# EAGLE design mbed_bob4 (EAGLE 6.4)
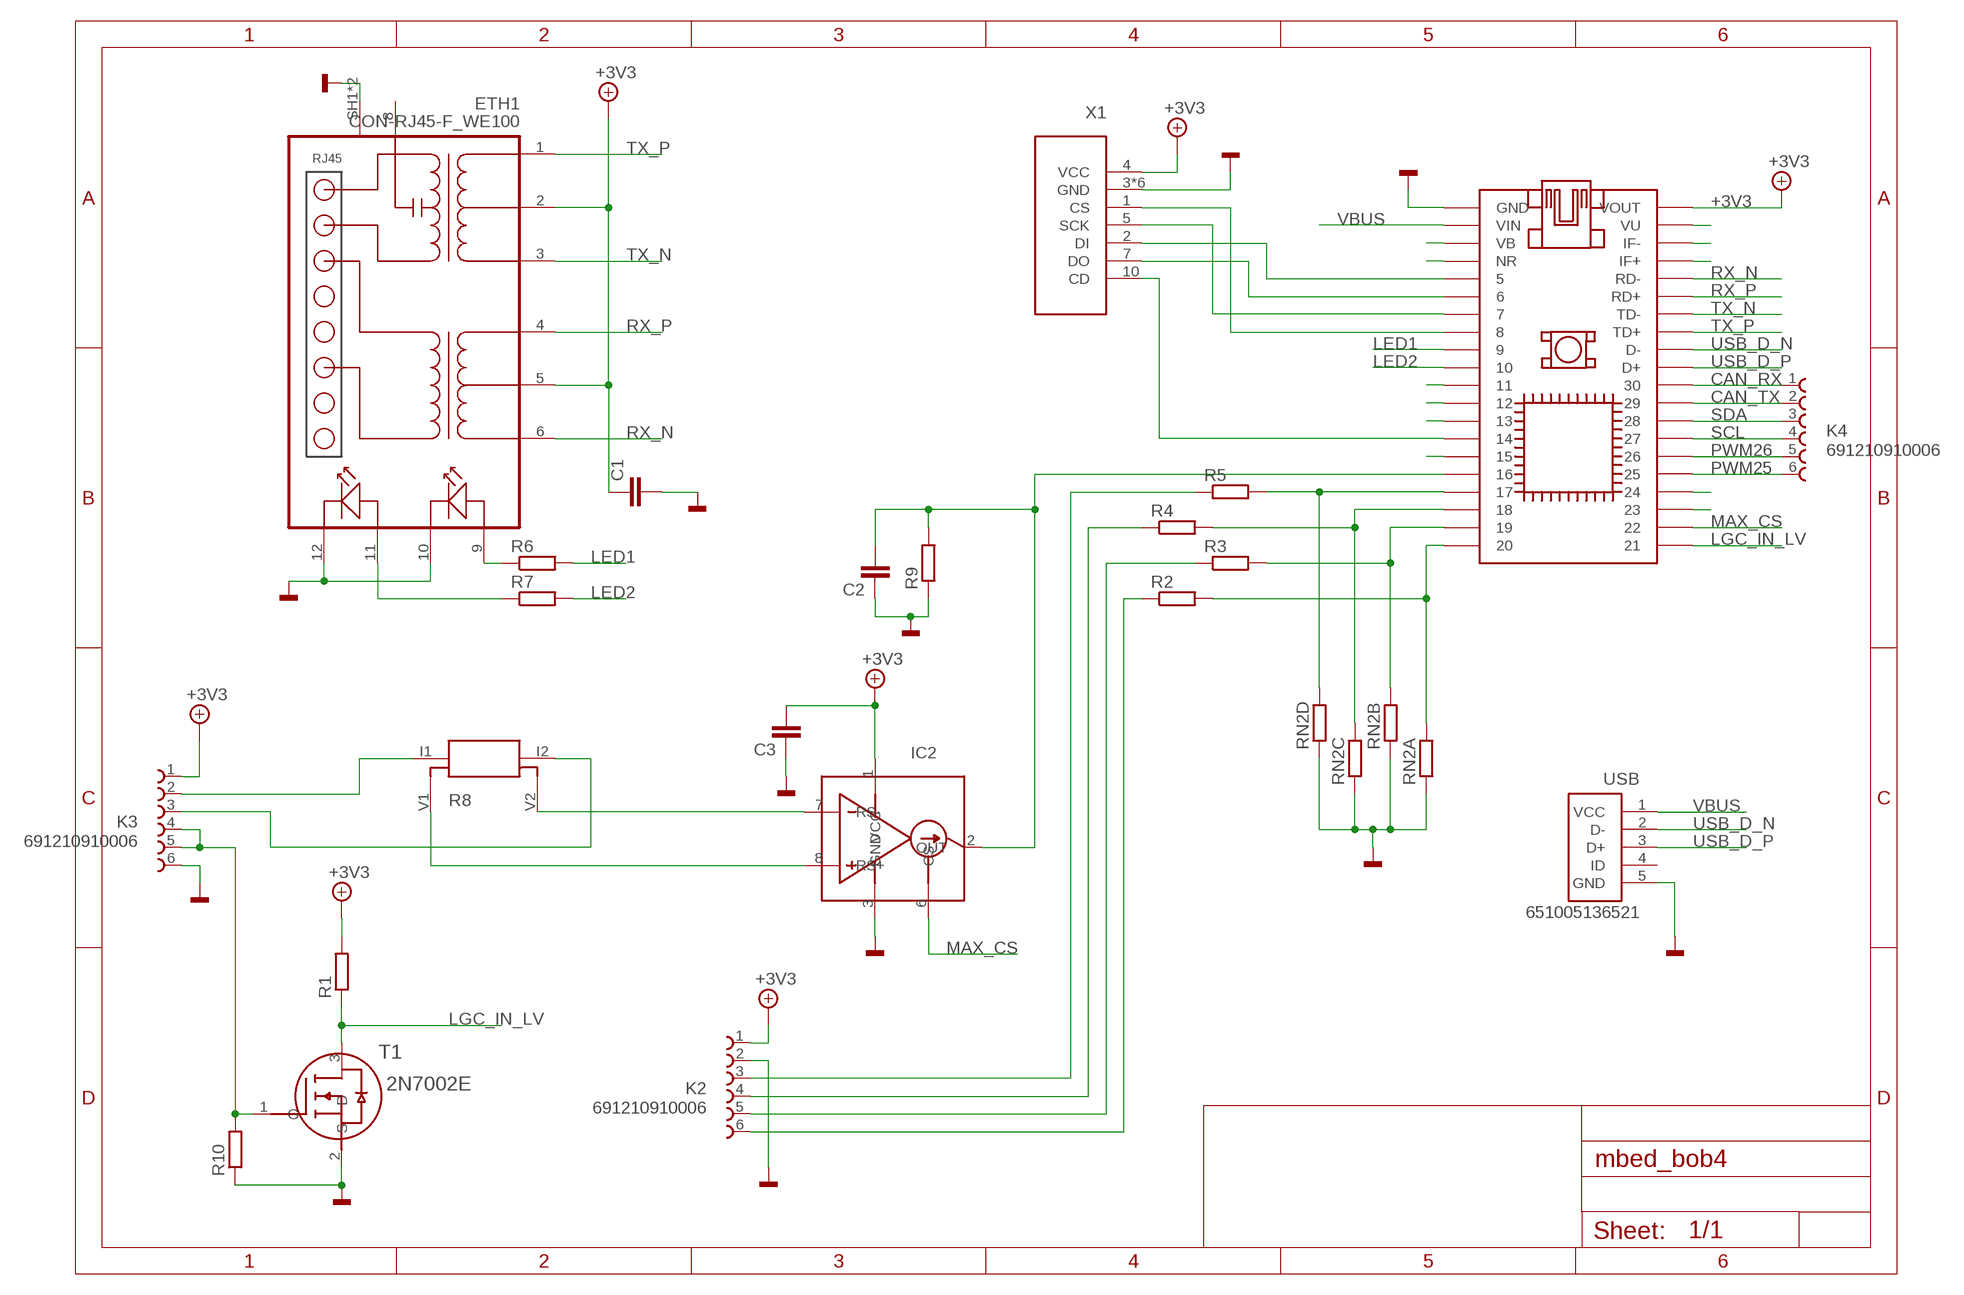
[diagram p0: schematic, sheet 1]

## Parts
C1  C0805_RFLW  [0805_RFLW]
C2  C0805_RFLW  [0805_RFLW]
C3  C0805_RFLW  [0805_RFLW]
ETH1  CON-RJ45-F_WE100  [74990111215A]
IC1  MBED-SOCKET  [MBED-SOCKET]
IC2  MAX9934  [UMAX8]
K2  691210910006  [691210910006]
K3  691210910006  [691210910006]
K4  691210910006  [691210910006]
R1  R0805_RFLW  [0805_RFLW]
R2  R0805_RFLW  [0805_RFLW]
R3  R0805_RFLW  [0805_RFLW]
R4  R0805_RFLW  [0805_RFLW]
R5  R0805_RFLW  [0805_RFLW]
R6  R0805_RFLW  [0805_RFLW]
R7  R0805_RFLW  [0805_RFLW]
R8  R_KELVIN  [R_KELVIN_1206]
R9  R0805_RFLW  [0805_RFLW]
R10  R0805_RFLW  [0805_RFLW]
RN2  RESISTOR_ARRAY_4TC164  [RN_TC164]
T1  2N7002E  [SOT23-3L]
USB  651005136521  [651005136521]
X1  SDCARDSHORT  [SD_SHORT]

## Nets
+3V3: C1.P$3 C3.P$4 ETH1.2(CTD) ETH1.5(CRD) IC1.VOUT IC1.VOUTA(VOUT) IC2.1(VCC) K2.1 K3.1 R1.P$4 X1.4(VCC)
CAN_RX: IC1.30 IC1.30A K4.1
CAN_TX: IC1.29 IC1.29A K4.2
GND: C1.P$4 C2.P$3 C3.P$3 ETH1.10(YELLOW_CATHODE) ETH1.12(GREEN_CATHODE) ETH1.SH1(SHIELD) ETH1.SH2(SHIELD) IC1.GND IC1.GNDA(GND) IC2.3(GND) K2.2 K3.6 R9.P$3 R10.P$3 RN2.1 RN2.2 RN2.3 RN2.4 T1.2(S) USB.5(GND) X1.3(GND) X1.6(GND) X1.GND@1(GND) X1.GND@2(GND) X1.GND@3(GND) X1.GND@4(GND)
LED1: IC1.9 IC1.9A R6.P$4
LED2: IC1.10 IC1.10A R7.P$4
LGC_IN_LV: IC1.21 IC1.21A R1.P$3 T1.3(D)
MAX_CS: IC1.22 IC1.22A IC2.6(CS)
N$1: IC1.17 IC1.17A R5.P$4 RN2.5
N$3: IC1.14 IC1.14A X1.10(CD)
N$4: K2.6 R2.P$3
N$5: IC1.20 IC1.20A R2.P$4 RN2.8
N$6: IC1.19 IC1.19A R3.P$4 RN2.7
N$7: IC1.18 IC1.18A R4.P$4 RN2.6
N$8: K2.5 R3.P$3
N$9: K2.4 R4.P$3
N$10: K2.3 R5.P$3
N$11: ETH1.11(GREEN_ANODE) R7.P$3
N$12: ETH1.9(YELLOW_ANODE) R6.P$3
N$13: K3.4 K3.5 R10.P$4 T1.1(G)
N$14: IC1.7 IC1.7A X1.5(SCK)
N$15: IC1.8 IC1.8A X1.1(CS)
N$16: IC1.5 IC1.5A X1.2(DI)
N$17: IC1.6 IC1.6A X1.7(DO)
N$18: IC1.VB IC1.VBA(VB)
N$19: IC1.NR IC1.NRA(NR)
N$20: IC1.11 IC1.11A
N$21: IC1.12 IC1.12A
N$22: IC1.13 IC1.13A
N$23: IC1.15 IC1.15A
N$24: C2.P$4 IC1.16 IC1.16A IC2.2(OUT) R9.P$4
N$25: K3.2 R8.I1
N$26: IC1.23 IC1.23A
N$27: IC1.24 IC1.24A
N$28: IC1.IF+ IC1.IF+A(IF+)
N$29: IC1.IF- IC1.IF-A(IF-)
N$30: IC1.VU IC1.VUA(VU)
N$31: IC2.7(RS-) R8.V2
N$32: IC2.8(RS+) R8.V1
N$33: K3.3 R8.I2
PWM25: IC1.25 IC1.25A K4.6
PWM26: IC1.26 IC1.26A K4.5
RX_N: ETH1.6(RD-) IC1.RD- IC1.RD-A(RD-)
RX_P: ETH1.4(RD+) IC1.RD+ IC1.RD+A(RD+)
SCL: IC1.27 IC1.27A K4.4
SDA: IC1.28 IC1.28A K4.3
TX_N: ETH1.3(TD-) IC1.TD- IC1.TD-A(TD-)
TX_P: ETH1.1(TD+) IC1.TD+ IC1.TD+A(TD+)
USB_D_N: IC1.D- IC1.D-A(D-) USB.2(D-)
USB_D_P: IC1.D+ IC1.D+A(D+) USB.3(D+)
VBUS: IC1.VIN IC1.VINA(VIN) USB.1(VCC)
Unconnected: ETH1.8(EXT_TAP) USB.4(ID)

## Library data of the parts
C1-C3 = passives:C: SMT capacitor
ETH1 = connectors:CON-RJ45-F: Female Ethernet RJ-45 with internal transformer and 2 LEDs; MF: Wuerth Elektronik; MPN: 74990111215A
IC1 = modules:MBED-SOCKET
IC2 = ic:MAX9934; MF: Maxim; MPN: MAX9934
K2-K4 = Wuerth_Elektronik_eiCan_14_Terminal_Blocks_WR-TBL_2_0:691210910006: WR-TBL Serie 2109 - 2.54mm Horizontal Entry Modular with Rising Cage Clamp - 0.8mm2 Wires, 6 Pins
R1-R7 R9 R10 = passives:R: SMD resistor
R8 = passives:R_KELVIN; MF: Ohmite; SERIES: LVK12
RN2 = passives:RESISTOR_ARRAY_4: 4 Resistor Array 0603; MF: Yageo
T1 = ic:2N7002E: N-channel TrenchMOS FET; MF: NXP; MPN: 2N7002E
USB = Wuerth_Elektronik_eiCan_11_Communication_Connectors_2_4:651005136521: WR-COM Horizontal 5 Contacts Mini USB Typ B
X1 = connectors:SDCARD: SD CARD holder; MF: Wuerth Elektronik; MPN: 693063020911

## Net classes
1 power: width 0.3 mm, drill 0.35 mm, clearance 0.2 mm

## Board
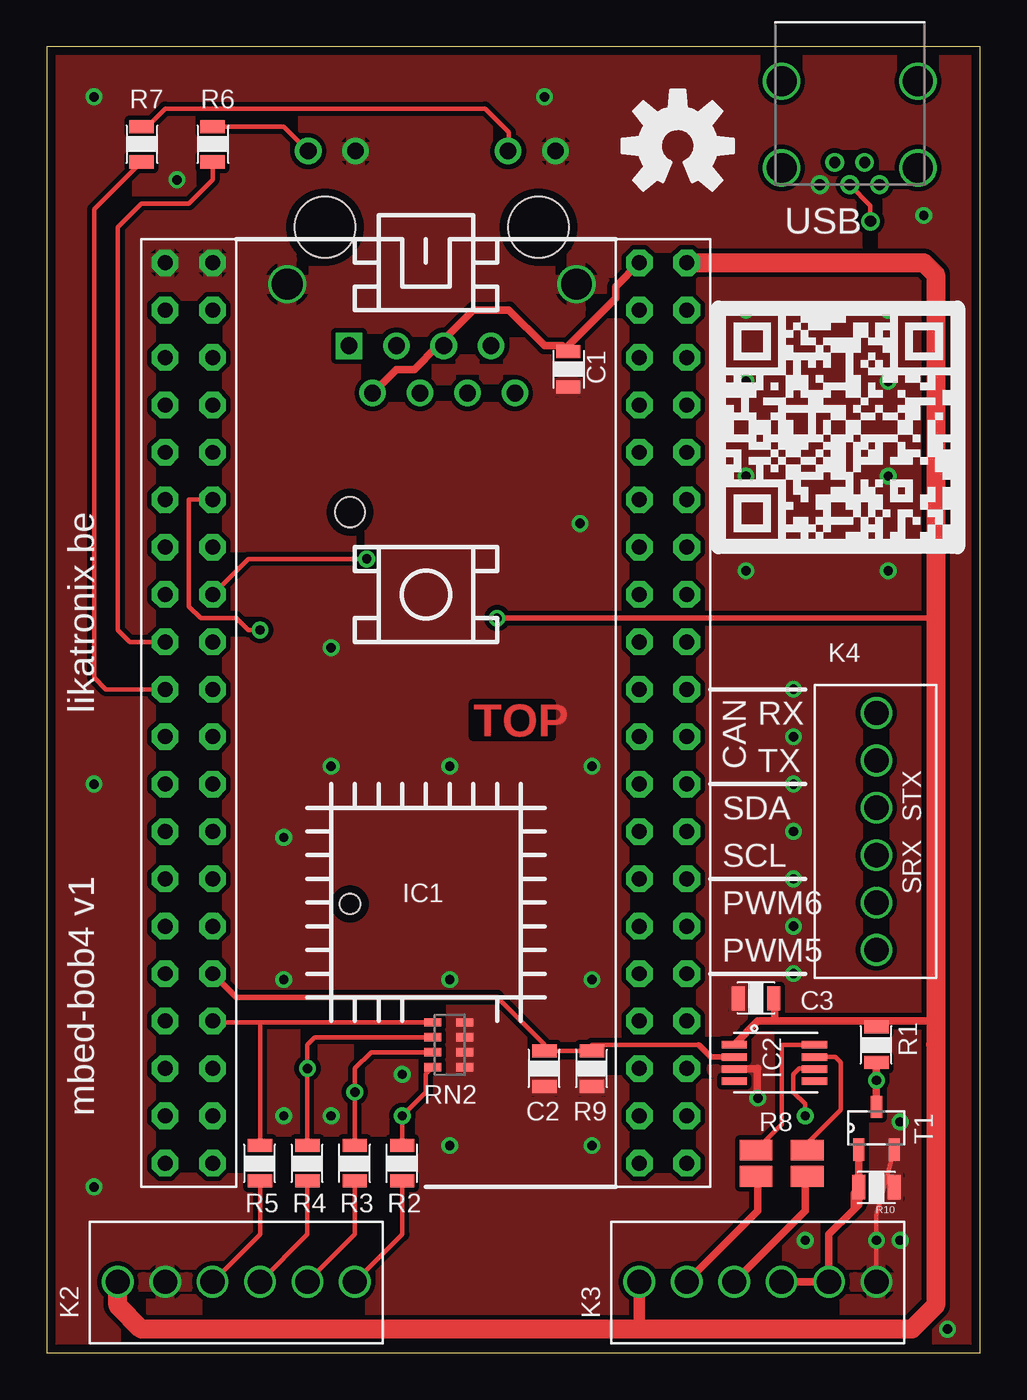
[diagram p1: board, top side]
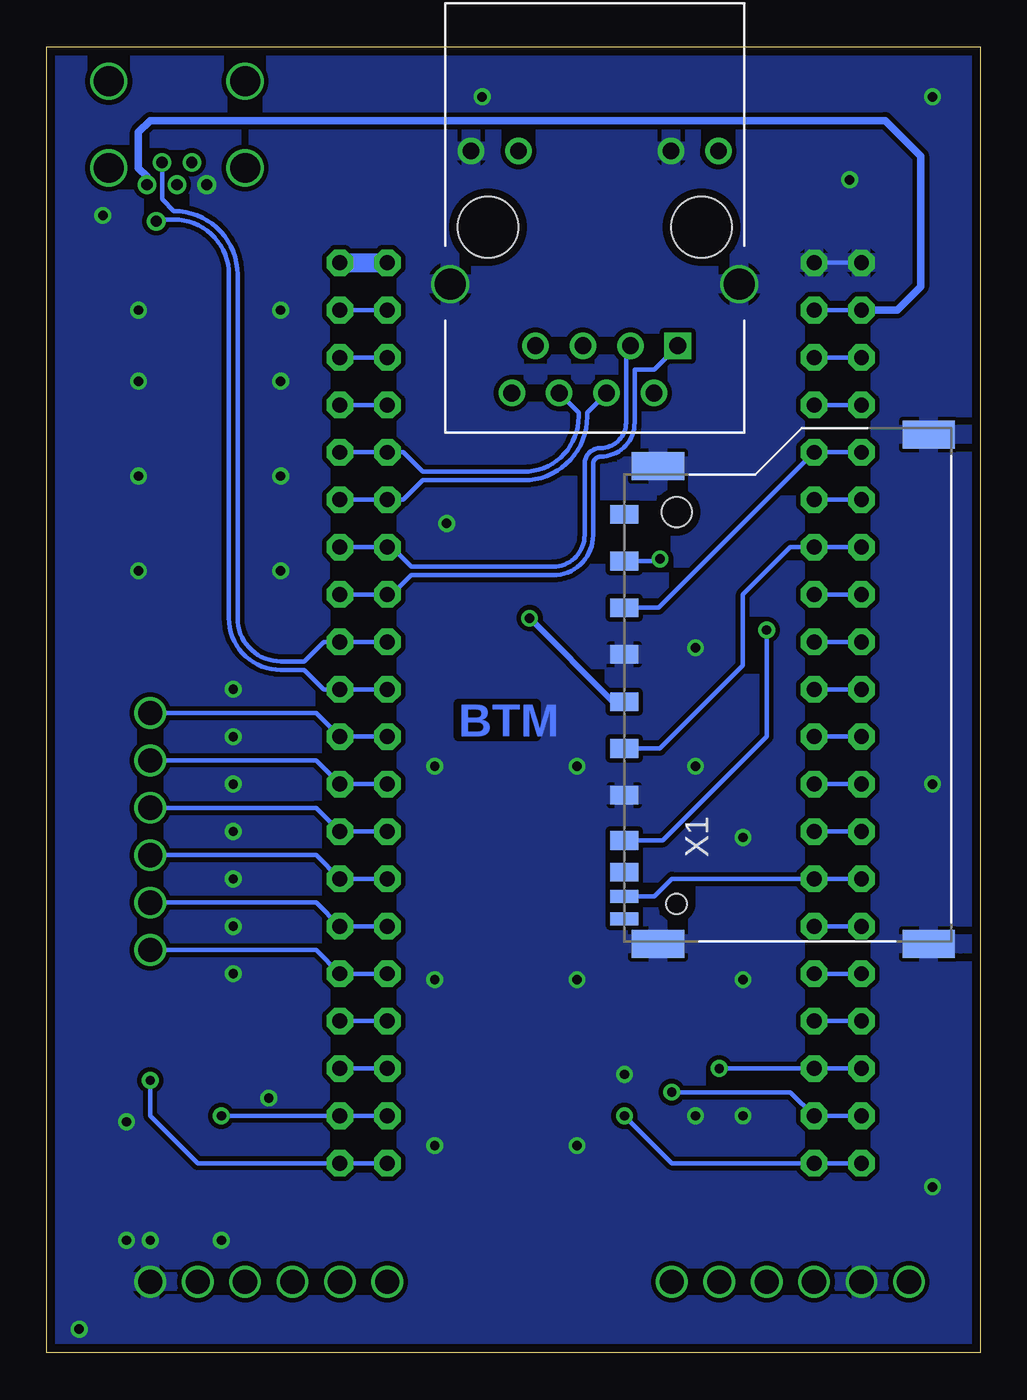
[diagram p2: board, bottom side, seen from below]

Size 50 x 70 mm. Coordinates in mm from the lower left corner, seen from the top.
Outline: 0,0 50,0 50,70 0,70 0,0
Copper layers (1*16): Top 0.018mm / dielectric 1.55mm / Bottom 0.018mm
Design rules "eC-STANDARD_pool-2-layer  *": minimum track width 0.15mm, minimum drill 0.25mm, track to track 0.15mm, track to pad 0.15mm, pad to pad 0.15mm, via to via 0.15mm, smd to smd 0.15mm, copper to edge 0.45mm, drill to drill 0.3mm, minimum pad ring 0.2mm, minimum via ring 0.2mm, stop-mask expansion 0.1mm, vias tented up to drill 0.5mm, thermal gap 0.2mm

### Footprints (pad centres in the part's own frame; a part is rotated, then mirrored left to right if it is on the bottom)
0805_RFLW = smd 0.7 x 1.3: P$3 -0.95,0; P$4 0.95,0
74990111215A = drill 0.89 pad 1.422 square: 1 4.445,-6.35 | drill 0.89 pad 1.422: 2 3.175,-8.89; 3 1.905,-6.35; 4 0.635,-8.89; 5 -0.635,-6.35; 6 -1.905,-8.89; 7 -3.175,-6.35; 8 -4.445,-8.89; 9 6.625,4.08; 10 4.085,4.08; 11 -4.085,4.08; 12 -6.625,4.08 | drill 1.65: SH1 -7.745,-3.05; SH2 7.745,-3.05 | hole 3.25: 5.715,0; -5.715,0
MBED-SOCKET = drill 0.8 pad 1.422 octagon: 5 -2.54,-10.16; 5A 0,-10.16; 6 -2.54,-12.7; 6A 0,-12.7; 7 -2.54,-15.24; 7A 0,-15.24; 8 -2.54,-17.78; 8A 0,-17.78; 9 -2.54,-20.32; 9A 0,-20.32; 10 -2.54,-22.86; 10A 0,-22.86; 11 -2.54,-25.4; 11A 0,-25.4; 12 -2.54,-27.94; 12A 0,-27.94; 13 -2.54,-30.48; 13A 0,-30.48; 14 -2.54,-33.02; 14A 0,-33.02; 15 -2.54,-35.56; 15A 0,-35.56; 16 -2.54,-38.1; 16A 0,-38.1; 17 -2.54,-40.64; 17A 0,-40.64; 18 -2.54,-43.18; 18A 0,-43.18; 19 -2.54,-45.72; 19A 0,-45.72; 20 -2.54,-48.26; 20A 0,-48.26; 21 25.4,-48.26; 21A 22.86,-48.26; 22 25.4,-45.72; 22A 22.86,-45.72; 23 25.4,-43.18; 23A 22.86,-43.18; 24 25.4,-40.64; 24A 22.86,-40.64; 25 25.4,-38.1; 25A 22.86,-38.1; 26 25.4,-35.56; 26A 22.86,-35.56; 27 25.4,-33.02; 27A 22.86,-33.02; 28 25.4,-30.48; 28A 22.86,-30.48; 29 25.4,-27.94; 29A 22.86,-27.94; 30 25.4,-25.4; 30A 22.86,-25.4; D+ 25.4,-22.86; D+A 22.86,-22.86; D- 25.4,-20.32; D-A 22.86,-20.32; GND -2.54,0; GNDA 0,0; IF+ 25.4,-7.62; IF+A 22.86,-7.62; IF- 25.4,-5.08; IF-A 22.86,-5.08; NR -2.54,-7.62; NRA 0,-7.62; RD+ 25.4,-12.7; RD+A 22.86,-12.7; RD- 25.4,-10.16; RD-A 22.86,-10.16; TD+ 25.4,-17.78; TD+A 22.86,-17.78; TD- 25.4,-15.24; TD-A 22.86,-15.24; VB -2.54,-5.08; VBA 0,-5.08; VIN -2.54,-2.54; VINA 0,-2.54; VOUT 25.4,0; VOUTA 22.86,0; VU 25.4,-2.54; VUA 22.86,-2.54
UMAX8 = smd 1.35 x 0.4: 1 0,0; 2 0,-0.65; 3 0,-1.3; 4 0,-1.95; 5 4.3,-1.95; 6 4.3,-1.3; 7 4.3,-0.65; 8 4.3,0
691210910006 = drill 1.3: 1 -2.54,0; 2 0,0; 3 2.54,0; 4 5.08,0; 5 7.62,0; 6 10.16,0
R_KELVIN_1206 = smd 1.75 x 1.1: I1 -1.375,-0.7; I2 1.375,-0.7; V1 -1.375,0.7; V2 1.375,0.7
RN_TC164 = smd 0.45 x 0.9: 1 -1.2,-0.8; 2 -0.4,-0.8; 3 0.4,-0.8; 4 1.2,-0.8; 5 1.2,0.9; 6 0.4,0.9; 7 -0.4,0.9; 8 -1.2,0.9
SOT23-3L = smd 0.6 x 1.2: 1 -0.95,-1.18; 2 0.95,-1.18; 3 0,1.12
651005136521 = drill 0.6: 1 1.6,-0.9; 2 0.8,0.3; 3 0,-0.9; 4 -0.8,0.3; 5 -1.6,-0.9 | drill 1.6: 6 -3.65,0; 7 -3.65,4.65; 8 3.65,4.65; 9 3.65,0
SD_SHORT = smd 1 x 1.5: 1 6.875,0; 2 4.375,0; 3 1.875,0; 4 -0.675,0; 5 -3.175,0; 6 -5.675,0; 7 -8.1,0; 8 -9.8,0; 9 9.375,0 | smd 0.7 x 1.5: 10 -11.1,0; 11 -12.3,0 | smd 1.5 x 2.8: GND@1 -13.65,-1.8; GND@2 -13.65,-16.3; GND@3 13.65,-16.3; GND@4 11.95,-1.8 | hole 1.1: -11.5,-2.8 | hole 1.6: 9.5,-2.8

### Placement (x,y rotation side)
C1  27.94,52.7 270 top
C2  26.67,15.24 90 top
C3  38,19 0 top
ETH1  20.64,60.33 0 bottom
IC1  8.89,58.42 0 top
IC2  36.83,16.51 0 top
K2  6.35,3.81 0 top
K3  34.29,3.81 0 top
K4  44.45,31.75 270 top
R1  44.45,16.51 90 top
R2  19.05,10.16 90 top
R3  16.51,10.16 90 top
R4  13.97,10.16 90 top
R5  11.43,10.16 90 top
R6  8.89,64.77 270 top
R7  5.08,64.77 270 top
R8  39.37,10.16 0 top
R9  29.21,15.24 90 top
R10  44.45,8.89 180 top
RN2  21.59,16.51 90 top
T1  44.45,12.06 0 top
USB  43.02,63.5 0 top
X1  19.05,35.56 90 bottom

### Tracks (layer width: path | path; a pad name or v marks a point on that pad's centre or on a via)
+3V3  (via drill 0.5)
  Top 0.254: ETH1.5 20.95,53.98 | 47.3,16.19 47.62,16.51
  Top 0.305: v24.13,39.37 47.62,39.37
  Top 0.406: 20.95,53.98 19.68,52.7 18.73,52.7 ETH1.2 | 21.27,54.29 22.86,55.88 24.77,55.88 26.67,53.98 27.62,53.98 C1.P$3 27.94,53.98 30.48,56.52 30.48,57.15 IC1.VOUTA | IC2.1 38.1,17.78 39,17.78 | 39,17.78 44.45,17.78 | 44.45,17.78 47.62,17.78 | R1.P$4 44.45,17.78 | C3.P$4 39,19 39,17.78
  Top 0.61: ETH1.5 21.27,54.29 | K3.1 31.75,1.27
  Top 1.016: IC1.VOUT 46.99,58.42 47.62,57.78 47.62,39.37 47.62,17.78 47.62,16.51 47.62,2.54 46.35,1.27 31.75,1.27 5.08,1.27 3.81,2.54 K2.1
  Bottom 0.305: X1.4 19.64,34.88 v24.13,39.37
  Bottom 1.016: IC1.VOUT IC1.VOUTA
CAN_RX
  Bottom 0.254: IC1.30A IC1.30 35.56,34.29 K4.1
CAN_TX
  Bottom 0.254: IC1.29A IC1.29 35.56,31.75 K4.2
GND  (via drill 0.5)
  Top 0.254: K3.6 44.45,7.39 T1.2
  Top 0.406: IC2.3 38.07,15.21 | 38.07,15.21 38.1,15.24 | 38.07,15.21 38.07,13.68 v38.1,13.65
  Bottom 0.254: IC1.GND IC1.GNDA
  other vias: 6.99,62.87 28.57,44.45 40.01,25.4 40.01,27.94 40.01,30.48 40.01,33.02 45.09,41.91 45.09,46.99 45.09,52.07 37.47,52.07 37.47,46.99 37.47,41.91 19.05,14.92 15.24,12.7 12.7,12.7 12.7,20 21.59,20 12.7,27.62 15.24,31.43 15.24,37.78 21.59,31.43 45.72,6.03 44.45,6.03 45.72,12.38 40.64,6.03 40.01,22.86 40.01,20.32 40.01,35.56 37.47,55.88 45.09,55.88 21.59,11.11 29.21,11.11 29.21,20 29.21,31.43 2.54,8.89 2.54,30.48 2.54,67.31 26.67,67.31 46.99,60.96 48.26,1.27
  pour Bottom (isolate 0.25): 0,0 0,69.85 49.53,69.85 49.53,0
  pour Top (isolate 0.25): 0,0 0,69.85 49.53,69.85 49.53,0
LED1
  Top 0.254: R6.P$4 8.89,62.87 7.62,61.59 5.08,61.59 3.81,60.33 3.81,38.73 4.45,38.1 IC1.9
  Bottom 0.254: IC1.9A IC1.9
LED2
  Top 0.254: IC1.10 3.17,35.56 2.54,36.2 2.54,61.28 R7.P$4
  Bottom 0.254: IC1.10A IC1.10
LGC_IN_LV  (via drill 0.5)
  Top 0.406: T1.3 v44.45,14.61 R1.P$3
  Bottom 0.254: IC1.21A IC1.21 41.91,10.16 44.45,12.7 v44.45,14.61
MAX_CS  (via drill 0.5)
  Top 0.254: v40.64,12.7 40.64,13.34 40.01,13.97 40.01,14.92 40.32,15.24 41.1,15.24 IC2.6
  Bottom 0.254: IC1.22A IC1.22 v40.64,12.7
N$1
  Top 0.254: RN2.5 11.43,17.71 | 11.43,17.71 8.96,17.71 IC1.17A | R5.P$4 11.43,17.71
  Bottom 0.254: IC1.17A IC1.17
N$3
  Bottom 0.254: X1.10 17.45,24.46 16.51,25.4 IC1.14A IC1.14
N$4
  Top 0.254: K2.6 19.05,6.35 R2.P$3
N$5  (via drill 0.5)
  Top 0.254: R2.P$4 v19.05,12.7 19.35,12.7 19.35,13 20.32,13.97 20.32,14.94 RN2.8
  Bottom 0.254: v19.05,12.7 16.51,10.16 IC1.20A IC1.20
N$6  (via drill 0.5)
  Top 0.254: R3.P$4 v16.51,13.97 16.51,15.24 17.38,16.11 RN2.7
  Bottom 0.254: v16.51,13.97 10.16,13.97 IC1.19A IC1.19
N$7  (via drill 0.5)
  Top 0.254: R4.P$4 v13.97,15.24 13.97,16.51 14.37,16.91 RN2.6
  Bottom 0.254: v13.97,15.24 IC1.18A IC1.18
N$8
  Top 0.254: K2.5 16.51,6.35 R3.P$3
N$9
  Top 0.254: K2.4 13.97,6.35 R4.P$3
N$10
  Top 0.254: K2.3 11.43,6.35 R5.P$3
N$11
  Top 0.254: R7.P$3 5.39,65.72 6.35,66.67 23.5,66.67 24.77,65.41 24.77,64.45 ETH1.11
N$12
  Top 0.254: R6.P$3 12.7,65.72 ETH1.9
N$13
  Top 0.254: R10.P$4 43.18,8.57 43.18,7.62
  Top 0.406: K3.4 K3.5 41.91,6.35 43.18,7.62 43.5,7.94 R10.P$4 T1.1
N$14
  Bottom 0.254: X1.5 17.14,32.38 12.7,36.83 12.7,40.64 10.16,43.18 IC1.7A IC1.7
N$15  (via drill 0.5)
  Top 0.254: v17.14,42.55 10.79,42.55 IC1.8A
  Bottom 0.254: IC1.8 IC1.8A | X1.1 17.25,42.44 v17.14,42.55
N$16
  Bottom 0.254: X1.2 17.21,39.94 IC1.5A IC1.5
N$17  (via drill 0.5)
  Top 0.254: v11.43,38.73 10.79,38.73 10.16,39.37 8.26,39.37 7.62,40.01 7.62,45.72 IC1.6A
  Bottom 0.254: IC1.6A IC1.6 | X1.7 16.99,27.46 11.43,33.02 v11.43,38.73
N$18
  Bottom 0.254: IC1.VBA IC1.VB
N$19
  Bottom 0.254: IC1.NRA IC1.NR
N$20
  Bottom 0.254: IC1.11A IC1.11
N$21
  Bottom 0.254: IC1.12 IC1.12A
N$22
  Bottom 0.254: IC1.13A IC1.13
N$23
  Bottom 0.254: IC1.15A IC1.15
N$24
  Top 0.254: 34.92,16.51 29.21,16.51 R9.P$4 C2.P$4 26.67,16.51 24.13,19.05
  Top 0.305: IC2.2 35.58,15.86 34.92,16.51 | 24.13,19.05 10.16,19.05 IC1.16A
  Bottom 0.254: IC1.16A IC1.16
N$25
  Top 0.406: K3.2 38.1,7.62 38.1,9.36 R8.I1
N$26
  Bottom 0.254: IC1.23 IC1.23A
N$27
  Bottom 0.254: IC1.24A IC1.24
N$28
  Bottom 0.254: IC1.IF+A IC1.IF+
N$29
  Bottom 0.254: IC1.IF- IC1.IF-A
N$30
  Bottom 0.254: IC1.VUA IC1.VU
N$31
  Top 0.254: R8.V2 40.74,11.22 42.55,13.02 42.55,15.56 42.24,15.86 IC2.7
N$32
  Top 0.254: IC2.8 39.37,16.51 39.37,12.23 R8.V1
N$33
  Top 0.406: K3.3 40.64,7.62 40.64,9.36 R8.I2
PWM25
  Bottom 0.254: IC1.25A IC1.25 35.56,21.59 K4.6
PWM26
  Bottom 0.254: IC1.26A IC1.26 35.56,24.13 K4.5
RX_N
  Bottom 0.254: ETH1.6 21.5,50.39 21.5,50.16 arc90 24.45,47.22 29.84,47.22 30.89,48.26 IC1.RD-A IC1.RD-
RX_P
  Bottom 0.254: ETH1.4 21.04,50.39 21.04,50.16 arc90 24.45,46.76 29.84,46.76 30.89,45.72 IC1.RD+A IC1.RD+
SCL
  Bottom 0.254: IC1.27A IC1.27 35.56,26.67 K4.4
SDA
  Bottom 0.254: K4.3 35.56,29.21 IC1.28 IC1.28A
TX_N
  Bottom 0.254: IC1.TD- IC1.TD-A 31.52,43.18 30.48,42.14 22.86,42.14 arc-90 21.18,43.81 21.18,47.62 arc90 20.32,48.49 arc-90 18.96,49.85 18.96,53.75 arc90 ETH1.3
TX_P
  Bottom 0.254: IC1.TD+ IC1.TD+A 31.52,40.64 30.48,41.68 22.86,41.68 arc-90 20.73,43.81 20.73,47.62 arc90 20.32,48.03 arc-90 18.5,49.85 18.5,52.7 17.46,52.7 ETH1.1
USB_D_N
  Bottom 0.254: IC1.D-A IC1.D- 35.15,38.1 36.2,37.06 37.47,37.06 arc90 39.78,39.37 39.78,57.78 arc-90 43.18,61.19 43.82,61.83 USB.2
USB_D_P  (via drill 0.6)
  Top 0.254: v44.13,60.64 44.13,61.49 USB.3
  Bottom 0.254: IC1.D+A IC1.D+ 35.15,35.56 36.2,36.6 37.47,36.6 arc90 40.23,39.37 40.23,57.78 arc-90 43.18,60.73 44.04,60.73 arc-90 v44.13,60.64
VBUS
  Bottom 0.254: IC1.VINA IC1.VIN
  Bottom 0.406: USB.1 44.62,63.03 45.09,63.5 45.09,65.41 44.45,66.04 5.08,66.04 3.17,64.14 3.17,57.15 4.45,55.88 IC1.VIN

### Text on the board
Top: TOP
Bottom: BTM
tPlace: likatronix.be | RX | CAN | TX | STX | SDA | SCL | SRX | PWM6 | PWM5 | mbed-bob4 v1